# Altium schematic sheet RJ45_breakout.SchDoc
size A4; SheetNumber: 1; SheetTotal: 1
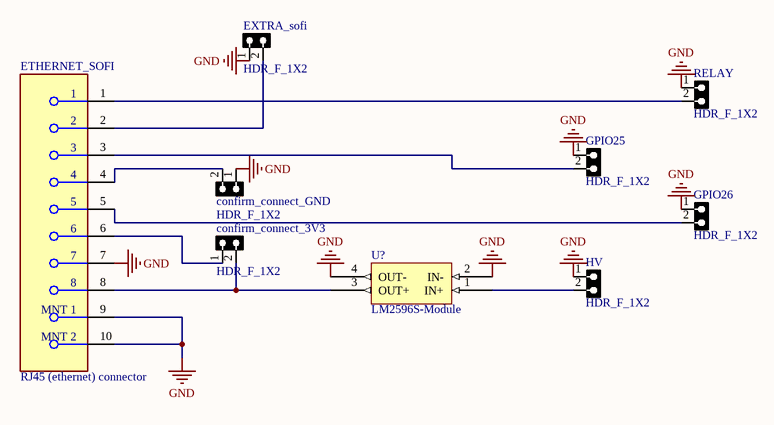
[diagram p0: RJ45_breakout.SchDoc]

## Parts
confirm_connect_3V3  HDR_F_1X2  [HDR_F_1X2]
confirm_connect_GND  HDR_F_1X2  [HDR_F_1X2]
ETHERNET_SOFI  RJ45 (ethernet) connector  [FP-1-406541-1-MFG]
EXTRA_sofi  HDR_F_1X2  [HDR_F_1X2]
GPIO25  HDR_F_1X2  [HDR_F_1X2]
GPIO26  HDR_F_1X2  [HDR_F_1X2]
HV  HDR_F_1X2  [HDR_F_1X2]
RELAY  HDR_F_1X2  [HDR_F_1X2]
U?  LM2596S-Module  [LM2596S-Footprint-1]

## Nets
GND: confirm_connect_GND.1 ETHERNET_SOFI.7 ETHERNET_SOFI.9(MNT_1) ETHERNET_SOFI.10(MNT_2) EXTRA_sofi.1 GPIO25.1 GPIO26.1 HV.1 RELAY.1 U?.2(IN-) U?.4(OUT-)
Netconfirm_connect_3V3_1: confirm_connect_3V3.1 ETHERNET_SOFI.6
Netconfirm_connect_3V3_2: confirm_connect_3V3.2 ETHERNET_SOFI.8 U?.3(OUT+)
Netconfirm_connect_GND_2: confirm_connect_GND.2 ETHERNET_SOFI.4
NetETHERNET_SOFI_1: ETHERNET_SOFI.1 RELAY.2
NetETHERNET_SOFI_2: ETHERNET_SOFI.2 EXTRA_sofi.2
NetETHERNET_SOFI_3: ETHERNET_SOFI.3 GPIO25.2
NetETHERNET_SOFI_5: ETHERNET_SOFI.5 GPIO26.2
NetHV_2: HV.2 U?.1(IN+)

## Library data of the parts
confirm_connect_3V3 confirm_connect_GND EXTRA_sofi GPIO25 GPIO26 HV RELAY = CMP-002-00274-1: VALUE: HDRF2; Design Item ID: HDR_F_1X2; Component Type: Standard; Pins: 2; Source: Conn Header.SchLib
ETHERNET_SOFI = CMP-002-00604-1: Modular Connector, RJ45 Jack, 1 x 1 (Port), 8P8C, Cat5, Through Hole Mount; Gender: Female; Pins: 2; Max Operating Temperature: 85°C; Min Operating Temperature: -40°C; Mounting Technology: Panel
U? = CMP-019-00050-5: ADIY Module LM2596S DC High Efficiency Voltage Regulator 3.0-40V To 1.5-35V Buck Converter Adjustable; Frequency: 150kHz; Output Voltage: 5V; Output Current: 2A; Dropout Voltage: 3.2V; Max Supply Voltage: 40V; Max Output Voltage: 35V; Pins: 4; URL: https://adiy.in/shop/lm2596-step-down-dc-dc-buck-converter-adjustable-module/; Case/Package: PCB; Min Supply Voltage: 3.2V